# EasyEDA Pro project 无刷电机驱动板.epro, board PCB4
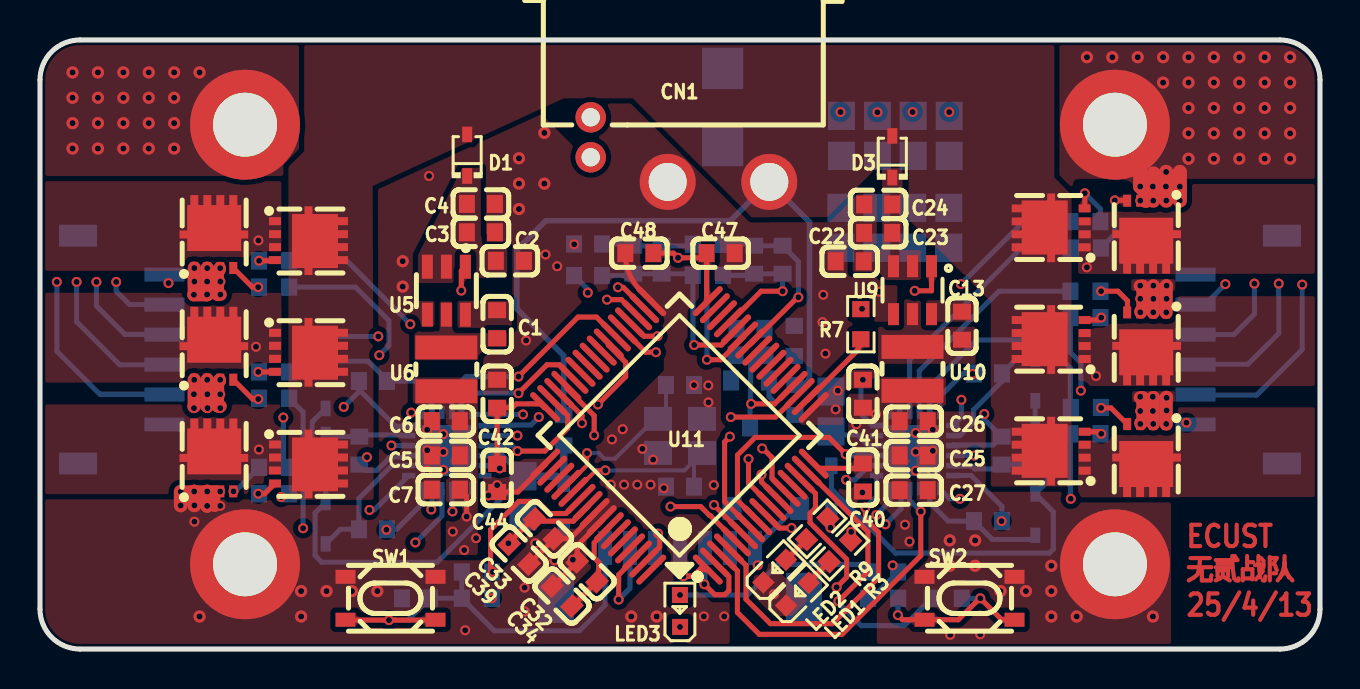
[diagram p11: board, top side]
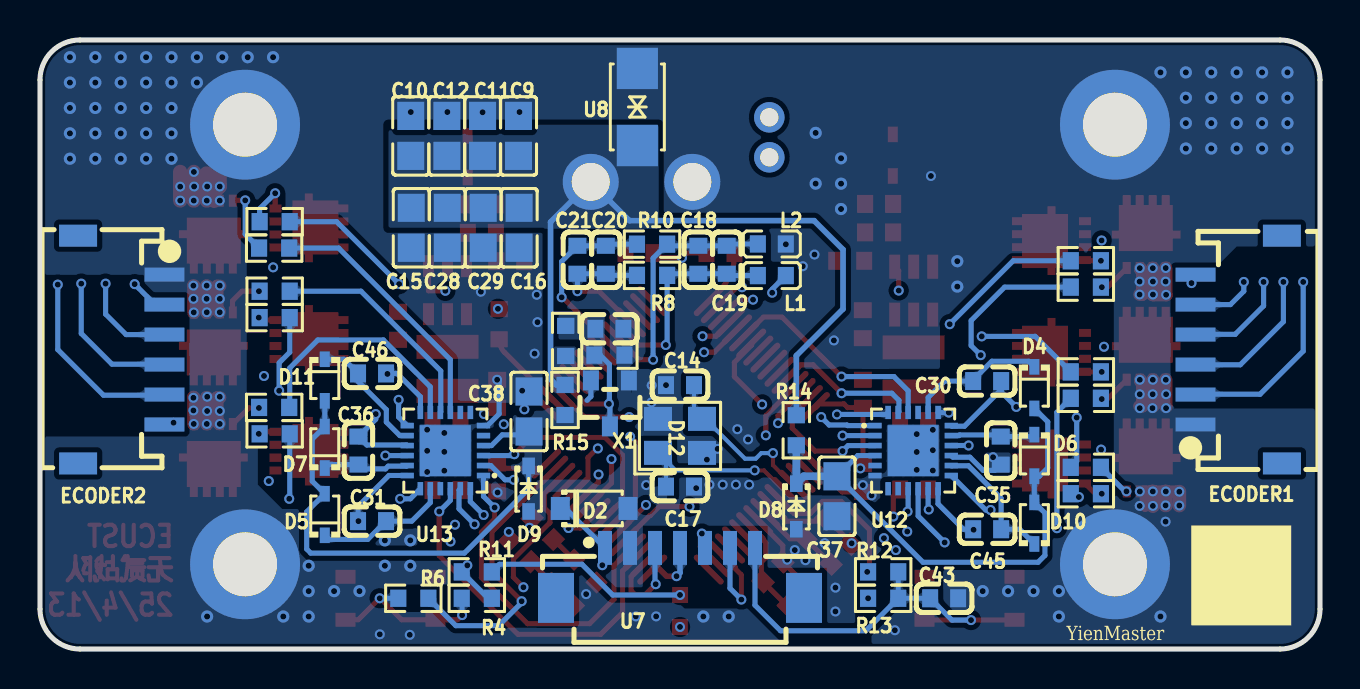
[diagram p12: board, bottom side, seen from below]

Outline 64.01 x 30.48 mm; copper layers: Top Layer, Inner1, Inner2, Bottom Layer. Coordinates in mm from the lower left corner of the outline.
Outline path: 0,28.48 0,2 arc(0.59,0.59) 2,0 62.01,0 arc(63.42,0.59) 64.01,2 64.01,28.48 arc(63.42,29.89) 62.01,30.48 2,30.48 arc(0.59,29.89) 0,28.48
Stack: Top Layer 0.035mm 外层铜厚1oz / Dielectric1 0.2104mm 7628 RC49% 8.6mil / Inner1 0.0152mm 内层铜厚 / Dielectric2 1.065mm 1.1mm H/HOZ Copper / Inner2 0.0152mm 内层铜厚 / Dielectric3 0.2104mm 7628 RC49% 8.6mil / Bottom Layer 0.035mm 外层铜厚1oz

## Design rules (mm)
net ECO_OUT: DP1
net ECO_IN: DP1
template: 自定义配置
spacing copperThickness1oz (default): track to track 0.102, other pairs 0.152 to 0.3
spacing copperThickness2oz: track to track 0.203, other pairs 0.152 to 0.3
track width copperThickness1oz (default): min 0.127, default 0.254, max 2.54
track width copperThickness2oz: min 0.203, default 0.254, max 2.54
differential pair differentialPair (default): width min 0.127, default 0.254, max 2.54; gap min 0.152, default 0.152
via viaSize (default): diameter min 0.5, default 0.61, max 10; hole min 0.3, default 0.305, max 6.3

## Placement (name value [footprint] x y rotation side)
C1  100nF  [C0603]  22.86 16.26 270 top
C2  10uF  [C0603]  23.5 19.43 180 top
C3  100nF  [C0603]  22.05 20.85 180 top
C4  10nF  [C0603]  22.05 22.28 180 top
C5  22uF  [C0603]  20.29 9.69 0 top
C6  22uF  [C0603]  20.29 11.4 0 top
C7  100nF  [C0603]  20.29 7.98 180 top
C9  22uF  [C0805]  40.08 25.68 270 bottom
C10  22uF  [C0805]  45.47 25.68 90 bottom
C11  22uF  [C0805]  41.88 25.68 270 bottom
C12  22uF  [C0805]  43.66 25.68 90 bottom
C13  100nF  [C0603]  46.1 16.18 270 top
C14  10pF  [C0603]  32 13.21 0 bottom
C15  22uF  [C0805]  45.44 21.08 90 bottom
C16  22uF  [C0805]  40.05 21.08 270 bottom
C17  10pF  [C0603]  32 8.13 0 bottom
C18  4.7uF  [C0603]  31.09 19.48 270 bottom
C19  100nF  [C0603]  29.67 19.48 270 bottom
C20  2.2uF  [C0603]  35.71 19.48 270 bottom
C21  100nF  [C0603]  37.13 19.48 270 bottom
C22  10uF  [C0603]  40.49 19.41 0 top
C23  100nF  [C0603]  41.91 20.83 0 top
C24  10nF  [C0603]  41.91 22.25 0 top
C25  22uF  [C0603]  43.69 9.68 180 top
C26  22uF  [C0603]  43.69 11.4 180 top
C27  100nF  [C0603]  43.69 7.95 0 top
C28  22uF  [C0805]  43.64 21.08 90 bottom
C29  22uF  [C0805]  41.85 21.08 270 bottom
C30  4.7uF  [C0603]  16.65 13.41 0 bottom
C31  4.7uF  [C0603]  47.4 6.4 180 bottom
C32  4.7uF  [C0603]  27.36 3.87 135 top
C33  4.7uF  [C0603]  25.22 6.01 315 top
C34  100nF  [C0603]  26.1 2.65 135 top
C35  4.7uF  [C0603]  15.97 9.93 90 bottom
C36  4.7uF  [C0603]  48.08 9.93 270 bottom
C37  22uF  [C0805]  24.16 7.65 90 bottom
C38  22uF  [C0805]  39.56 11.89 270 bottom
C39  100nF  [C0603]  23.96 4.75 315 top
C40  4.7uF  [C0603]  41.15 8.59 90 top
C41  100nF  [C0603]  41.15 12.78 270 top
C42  4.7uF  [C0603]  22.86 12.78 90 top
C43  100nF  [C0603]  18.8 2.54 0 bottom
C44  100nF  [C0603]  22.86 8.56 270 top
C45  4.7uF  [C0603]  16.65 5.99 0 bottom
C46  4.7uF  [C0603]  47.4 13.79 180 bottom
C47  4.7uF  [C0603]  34.04 19.81 180 top
C48  100nF  [C0603]  29.97 19.81 0 top
C49  100nF  [C0603]  35.53 16.03 0 bottom
CN1  XT30PW(2+2)-M.G.B  [CONN-TH_4P-XT30PW-M]  32 24.99 180 top
D1  B5819WS  [SOD-323_L1.7-W1.3-LS2.5-FD]  21.36 24.71 270 top
D2  SMF3.3A  [SOD-123_L2.8-W1.8-LS3.7-RD]  36.3 7.04 180 bottom
D3  B5819WS  [SOD-323_L1.7-W1.3-LS2.5-FD]  42.62 24.64 270 top
D4  B5819WS  [SOD-323_L1.7-W1.3-LS2.5-FD]  14.28 13.08 90 bottom
D5  B5819WS  [SOD-323_L1.7-W1.3-LS2.5-FD]  49.77 6.73 270 bottom
D6  B5819WS  [SOD-323_L1.7-W1.3-LS2.5-FD]  14.28 9.69 90 bottom
D7  B5819WS  [SOD-323_L1.7-W1.3-LS2.5-FD]  49.77 10.1 270 bottom
D8  BZT52C15S  [SOD-323_L1.7-W1.3-LS2.6-RD]  26.19 7.14 270 bottom
D9  BZT52C15S  [SOD-323_L1.7-W1.3-LS2.6-RD]  39.57 8.03 270 bottom
D10  B5819WS  [SOD-323_L1.7-W1.3-LS2.5-FD]  14.28 6.3 270 bottom
D11  B5819WS  [SOD-323_L1.7-W1.3-LS2.5-FD]  49.77 13.46 90 bottom
D12  BAV99  [SOT-23_L2.9-W1.3-P1.90-LS2.4-BR]  35.51 12.29 90 bottom
ECODER1  ZH-6AWB  [CONN-SMD_6P-P1.50_ZH-6AWB]  4.06 14.99 90 bottom
ECODER2  ZH-6AWB  [CONN-SMD_6P-P1.50_ZH-6AWB]  59.94 14.99 270 bottom
L1  BLM18PG121SN1D  [L0603]  27.41 18.69 0 bottom
L2  BLM18PG121SN1D  [L0603]  27.41 20.27 0 bottom
LED1  NCD0603R1  [LED0603-RD_RED]  37.87 2.74 45 top
LED2  NCD0603R1  [LED0603-RD_RED]  36.74 3.9 45 top
LED3  NCD0603R1  [LED0603-RD_RED]  32 1.91 90 top
R3  10kΩ  [R0603]  40 4.9 225 top
R4  4.7kΩ  [R0603]  42.16 2.54 0 bottom
R6  100Ω  [R0603]  45.34 2.54 0 bottom
R7  100Ω  [R0603]  41.05 16.26 90 top
R8  0Ω  [R0603]  33.4 18.7 0 bottom
R9  1kΩ  [R0603]  38.86 6.01 225 top
R10  0Ω  [R0603]  33.4 20.26 0 bottom
R11  1kΩ  [R0603]  42.16 3.86 180 bottom
R12  100Ω  [R0603]  21.84 3.86 0 bottom
R13  10kΩ  [R0603]  21.84 2.54 0 bottom
R14  100Ω  [R0603]  26.19 10.95 270 bottom
R15  100Ω  [R0603]  37.75 12.47 270 bottom
R16  4.7Ω  [R0603]  11.71 19.43 180 bottom
R17  4.7Ω  [R0603]  11.71 13.87 180 bottom
R18  4.7Ω  [R0603]  11.71 7.77 180 bottom
R19  4.7Ω  [R0603]  52.27 10.77 0 bottom
R20  4.7Ω  [R0603]  52.27 16.59 0 bottom
R21  4.7Ω  [R0603]  52.27 21.39 0 bottom
R22  4.7Ω  [R0603]  11.71 18.11 180 bottom
R23  4.7Ω  [R0603]  11.71 12.55 180 bottom
R24  4.7Ω  [R0603]  11.71 9.09 180 bottom
R25  4.7Ω  [R0603]  52.3 12.09 0 bottom
R26  4.7Ω  [R0603]  52.27 17.91 0 bottom
R27  4.7Ω  [R0603]  52.3 20.07 0 bottom
R28  10kΩ  [R0603]  37.72 15.42 270 bottom
R29  1kΩ  [R0603]  35.53 14.71 0 bottom
SW1  TS3425BA  [SW-SMD_4P-L4.2-W3.2-P2.15-LS4.6-1]  17.53 2.54 0 top
SW2  TS3425BA  [SW-SMD_4P-L4.2-W3.2-P2.15-LS4.6-1]  46.48 2.54 0 top
U1  -  [M3螺丝孔]  10.25 26.24 0 top
U2  -  [M3螺丝孔]  53.75 26.24 0 top
U3  -  [M3螺丝孔]  10.25 4.24 0 top
U4  -  [M3螺丝孔]  53.75 4.24 0 top
U5  AP63205WU-7  [TSOT-23-6_L2.9-W1.6-P0.95-LS2.8-BL]  20.32 17.93 180 top
U6  4.7uH  [IND-SMD_L3.0-W3.0_FTC303020D]  20.32 14 270 top
U7  ZX-MX1.25-7PWT  [CONN-SMD_7P-P1.25_ZX-MX1.25-7PWT]  32 3.81 0 bottom
U8  SMAJ16CA  [DO-214AC_L4.3-W2.7-LS5.0-BI]  34.14 27.13 90 bottom
U9  AP63203WU-7  [TSOT-26_L2.9-W1.6-P0.95-LS2.8-BL]  43.63 17.96 180 top
U10  4.7uH  [IND-SMD_L3.0-W3.0_FTC303020D]  43.63 14.02 270 top
U11  CYT2BL3CAAQ0AZEGST  [LQFP-64_L10.0-W10.0-P0.50-LS12.0-BL]  31.98 10.69 45 top
U12  FD6288Q  [QFN-24_L4.0-W4.0-P0.50-BL-EP2.6]  20.34 9.93 270 bottom
U13  FD6288Q  [QFN-24_L4.0-W4.0-P0.50-BL-EP2.6]  43.74 9.93 90 bottom
U14  TPN2R703NL,L1Q(M  [TSON-8_L3.1-W3.1-P0.65-LS3.3-BL-EP]  13.43 20.44 270 top
U15  TPN2R703NL,L1Q(M  [TSON-8_L3.1-W3.1-P0.65-LS3.3-BL-EP]  13.43 14.85 270 top
U16  TPN2R703NL,L1Q(M  [TSON-8_L3.1-W3.1-P0.65-LS3.3-BL-EP]  13.43 9.26 270 top
U17  TPN2R703NL,L1Q(M  [TSON-8_L3.1-W3.1-P0.65-LS3.3-BL-EP]  50.56 9.9 90 top
U18  TPN2R703NL,L1Q(M  [TSON-8_L3.1-W3.1-P0.65-LS3.3-BL-EP]  50.56 15.49 90 top
U19  TPN2R703NL,L1Q(M  [TSON-8_L3.1-W3.1-P0.65-LS3.3-BL-EP]  50.56 21.08 90 top
U20  TPN2R703NL,L1Q(M  [TSON-8_L3.1-W3.1-P0.65-LS3.3-BL-EP]  8.69 20.74 0 top
U21  TPN2R703NL,L1Q(M  [TSON-8_L3.1-W3.1-P0.65-LS3.3-BL-EP]  8.69 15.15 0 top
U22  TPN2R703NL,L1Q(M  [TSON-8_L3.1-W3.1-P0.65-LS3.3-BL-EP]  8.69 9.57 0 top
U23  TPN2R703NL,L1Q(M  [TSON-8_L3.1-W3.1-P0.65-LS3.3-BL-EP]  55.34 9.58 180 top
U24  TPN2R703NL,L1Q(M  [TSON-8_L3.1-W3.1-P0.65-LS3.3-BL-EP]  55.34 15.17 180 top
U25  TPN2R703NL,L1Q(M  [TSON-8_L3.1-W3.1-P0.65-LS3.3-BL-EP]  55.34 20.76 180 top
U26  -  [JLC-QRCODE-5x5]  3.94 3.68 180 bottom
X1  16MHz  [CRYSTAL-SMD_4P-L3.2-W2.5-BL]  32 10.67 180 bottom

## Footprints (pads in the part's own frame, mm; a bottom-side part is the same pattern mirrored in y, then rotated)
C0603
  rect 0.8x0.9 smd: 1(-0.7,0) 2(0.7,0)
C0805
  rect 1.41x1.35 smd: 1(-1,0) 2(1,0)
CONN-SMD_6P-P1.50_ZH-6AWB
  rect 0.7x2 smd: 1(-3.75,2.16) 2(-2.25,2.16) 3(-0.75,2.16) 4(0.75,2.16) 5(2.25,2.16) 6(3.75,2.16)
  rect 1.1x1.9 smd: 7(5.7,-2.159) 8(-5.7,-2.16)
CONN-SMD_7P-P1.25_ZX-MX1.25-7PWT
  rect 0.7x1.7 smd: 1(3.75,-1.25) 2(2.5,-1.25) 3(1.25,-1.25) 4(0,-1.25) 5(-1.25,-1.25) 6(-2.5,-1.25) 7(-3.75,-1.25)
  rect 1.8x2.5 smd: 8(-6.2,1.25) 9(6.2,1.25)
CONN-TH_4P-XT30PW-M
  round 2.8 hole 1.9: 1(-4.465,1.615) 2(0.615,1.615)
  round 1.524 hole 0.914: 3(4.465,0.385) 4(4.465,-1.615)
CRYSTAL-SMD_4P-L3.2-W2.5-BL
  rect 1.4x1.2 smd: 1(-1.1,-0.85) 2(1.1,-0.85) 3(1.1,0.85) 4(-1.1,0.85)
DO-214AC_L4.3-W2.7-LS5.0-BI
  rect 2.07x2.06 smd: 1(-1.929,0) 2(1.929,0)
IND-SMD_L3.0-W3.0_FTC303020D
  rect 1.2x3.1 smd: 1(-1.1,0) 2(1.1,0)
L0603
  rect 0.8x0.864 smd: 1(-0.7,0) 2(0.7,0)
LED0603-RD_RED
  rect 0.8x0.8 smd: 1(-0.799,-0.004) 2(0.799,0.004)
LQFP-64_L10.0-W10.0-P0.50-LS12.0-BL
  oval 0.3x2 smd: 1(-3.75,-5.75) 2(-3.25,-5.75) 3(-2.75,-5.75) 4(-2.25,-5.75) 5(-1.75,-5.75) 6(-1.25,-5.75) 7(-0.75,-5.75) 8(-0.25,-5.75) 9(0.25,-5.75) 10(0.75,-5.75) 11(1.25,-5.75) 12(1.75,-5.75) 13(2.25,-5.75) 14(2.75,-5.75) 15(3.25,-5.75) 16(3.75,-5.75) 33(3.75,5.75) 34(3.25,5.75) 35(2.75,5.75) 36(2.25,5.75) 37(1.75,5.75) 38(1.25,5.75) 39(0.75,5.75) 40(0.25,5.75) 41(-0.25,5.75) 42(-0.75,5.75) 43(-1.25,5.75) 44(-1.75,5.75) 45(-2.25,5.75) 46(-2.75,5.75) 47(-3.25,5.75) 48(-3.75,5.75)
  oval 2x0.3 smd: 17(5.75,-3.75) 18(5.75,-3.25) 19(5.75,-2.75) 20(5.75,-2.25) 21(5.75,-1.75) 22(5.75,-1.25) 23(5.75,-0.75) 24(5.75,-0.25) 25(5.75,0.25) 26(5.75,0.75) 27(5.75,1.25) 28(5.75,1.75) 29(5.75,2.25) 30(5.75,2.75) 31(5.75,3.25) 32(5.75,3.75) 49(-5.75,3.75) 50(-5.75,3.25) 51(-5.75,2.75) 52(-5.75,2.25) 53(-5.75,1.75) 54(-5.75,1.25) 55(-5.75,0.75) 56(-5.75,0.25) 57(-5.75,-0.25) 58(-5.75,-0.75) 59(-5.75,-1.25) 60(-5.75,-1.75) 61(-5.75,-2.25) 62(-5.75,-2.75) 63(-5.75,-3.25) 64(-5.75,-3.75)
M3螺丝孔
  round 5.5 hole 3.2: 1(0,0)
QFN-24_L4.0-W4.0-P0.50-BL-EP2.6
  rect 0.28x0.665 smd: 1(-1.25,-1.907) 2(-0.75,-1.907) 3(-0.25,-1.907) 4(0.25,-1.907) 5(0.75,-1.907) 6(1.25,-1.907) 13(1.25,1.907) 14(0.75,1.907) 15(0.25,1.907) 16(-0.25,1.907) 17(-0.75,1.907) 18(-1.25,1.907)
  rect 0.665x0.28 smd: 7(1.907,-1.25) 8(1.907,-0.75) 9(1.907,-0.25) 10(1.907,0.25) 11(1.907,0.75) 12(1.907,1.25) 19(-1.907,1.25) 20(-1.907,0.75) 21(-1.907,0.25) 22(-1.907,-0.25) 23(-1.907,-0.75) 24(-1.907,-1.25)
  rect 2.55x2.55 smd: 25(0,0)
R0603
  rect 0.806x0.864 smd: 1(-0.753,0) 2(0.753,0)
SOD-123_L2.8-W1.8-LS3.7-RD
  rect 0.95x1.15 smd: 1(-1.692,0) 2(1.692,0)
SOD-323_L1.7-W1.3-LS2.5-FD
  rect 0.78x0.5 smd: 1(-1.04,0) 2(1.04,0)
SOD-323_L1.7-W1.3-LS2.6-RD
  rect 0.83x0.63 smd: 1(-1.14,0) 2(1.14,0)
SOT-23_L2.9-W1.3-P1.90-LS2.4-BR
  rect 1x0.8 smd: 1(1.15,-0.95) 2(1.15,0.95) 3(-1.15,0)
SW-SMD_4P-L4.2-W3.2-P2.15-LS4.6-1
  rect 1x0.7 smd: 1(-2.25,1.075) 2(2.25,1.075) 3(-2.25,-1.075) 4(2.25,-1.075)
TSON-8_L3.1-W3.1-P0.65-LS3.3-BL-EP
  rect 0.4x0.6 smd: 1(-0.975,-1.675) 2(-0.325,-1.675) 3(0.325,-1.675) 4(0.975,-1.675) 5(0.975,1.675) 6(0.325,1.675) 7(-0.325,1.675) 8(-0.975,1.675)
  rect 0.6x0.4 smd: 9(-1.42,0) 9(1.42,0)
  rect 2.7x2.3 smd: 9(0.02,0.325)
TSOT-23-6_L2.9-W1.6-P0.95-LS2.8-BL
  rect 0.55x1.2 smd: 1(-0.95,-1.2) 2(0,-1.2) 3(0.95,-1.2) 4(0.95,1.2) 5(0,1.2) 6(-0.95,1.2)
TSOT-26_L2.9-W1.6-P0.95-LS2.8-BL
  rect 0.55x1.1 smd: 1(-0.95,-1.2) 2(0,-1.2) 3(0.95,-1.2) 4(0.95,1.2) 5(0,1.2) 6(-0.95,1.2)

## Nets
As in the schematic.

Pads without a net: ECODER1 7 8; ECODER2 7 8; U7 8 9; U11 13 21 22 23 24 25 30 31 40 41 42 43 50 51 59 60 61 64; U12 5 7 8 21; U13 5 7 8 21

## Via types
v1: diameter 0.5, hole 0.3, Top Layer to Bottom Layer, 228 vias
v2: diameter 0.61, hole 0.305, Top Layer to Bottom Layer, 77 vias

## Routing (per net, layer and track width the routed paths; a pad name or vN(x,y) marks a point on that pad's centre or on a via; arc(x,y) is an arc through that point)
+5V: length 122.5
  Top Layer w0.254: C7.1 21.34,7.63 v1(21.34,6.63) ; v1(21.07,17.94) 21.07,18.93 U5.1
  Inner2 w0.254: 21.9,14.5 25.3,14.5 26.21,13.59 26.21,7.42 27.03,6.6 40.56,6.6 v1(40.56,5.86) ; 21.84,7.13 21.81,7.1 v1(21.34,6.63) ; 21.81,11.8 21.84,11.76 ; v1(21.07,17.94) 21.74,17.94
  Inner2 w0.381: v1(21.81,5.55) 21.81,24.27 26.52,28.98 36.32,28.98 44.89,20.41 55.89,20.41 57.71,18.59 57.71,11.71 v1(57.33,11.33) ; v1(20.64,5.88) 20.6,5.84 19.23,5.84 16.54,8.53 8.92,8.53 6.42,11.03 6.42,18.31 v1(6.43,18.31)
  vias: v1(21.21,4.95)
GND: length 48
  Top Layer w0.254: C48.1 29.27,19.76 arc(29.47,18.78) 30.02,17.96 30.59,17.39 ; 28.12,6.43 26.87,5.18 C32.2 25.64,3.14 C34.2 ; 27.76,6.78 26.5,5.52 25.72,5.52 C39.2 ; 25.29,9.25 23.89,7.86 C44.2
  Top Layer w0.508: 8.76,7.92 8.76,7.14 8.74,7.11
  Top Layer w0.635: 55.05,16.85 55.05,16.9 55.15,17 55.15,18.16 55.13,18.17 55.01,18.17 ; 8.76,7.87 v1(7.04,7.87) ; v1(9.02,17.74) 8.89,17.74 8.88,17.75 8.88,18.91 8.98,19.01 8.98,19.06 ; 55.01,12.59 55.13,12.59 55.15,12.58 55.15,11.42 55.05,11.32 55.05,11.26 ; 8.98,13.47 8.98,13.42 8.88,13.32 8.88,12.16 8.89,12.15 9.02,12.15
  Top Layer w0.66: v1(8.36,19.06) 8.36,17.75 v1(8.35,17.74) 8.34,17.73 v1(7.7,17.73) 7.72,17.75 v1(7.72,19.07) ; U21.1 7.72,12.16 7.7,12.14 ; 8.35,12.15 8.36,12.16 v1(8.36,13.47) ; 56.33,12.6 56.31,12.58 U23.1 ; v1(55.67,11.26) 55.67,12.58 55.68,12.59 ; 56.33,18.18 56.31,18.16 56.31,16.84 ; 55.67,16.85 55.67,18.16 55.68,18.17
  Top Layer w0.686: v1(7.04,7.87) v1(7.04,7.18) ; v1(7.71,7.89) 7.71,7.2 v1(7.72,7.19) ; v1(8.36,7.16) 8.36,7.17 v1(8.36,7.89)
  Top Layer w0.711: v1(56.31,23.88) 56.31,23.16 v1(56.3,23.15) 56.32,23.13 v1(56.32,22.44) ; U2.1 55.02,24.98 v1(55.02,23.15) 55.3,22.87 55.3,22.43 ; v1(57,22.44) v1(57,23.14) 57,23.88 ; 55.68,23.8 55.68,23.17 v1(55.65,23.15) 55.67,23.13 v1(55.67,22.44)
  Bottom Layer w0.254: v1(41.15,13.48) 41.05,13.38 41.05,11.76 41.63,11.18 U13.6
  vias: v1(7.72,18.39) v1(7.71,13.47) v1(7.7,12.75) v1(7.7,12.06) v1(7.72,6.38) v1(8.36,18.39) v1(8.37,12.75) v1(8.38,12.06) v1(9.01,19.06) v1(9.02,18.39) v1(9.01,13.47) v1(9.01,12.75) v1(9.01,12.06) v1(9.01,7.89) v1(9.02,7.16) v1(19.36,10.97) v1(19.36,9.95) v1(19.36,8.93) v1(19.46,23.67) v1(20.17,10.76) v1(20.17,9.86) v1(20.17,8.97) v1(21.26,0.94) v1(22.43,7.69) v1(22.86,8.2) v1(24.23,3.07) v1(24.23,1.88) v1(24.31,15.44) v1(24.77,5.3) v1(25.28,19.74) v1(25.73,4.45) v1(25.86,19.16) v1(26.26,4.95) v1(26.64,4.47) v1(26.71,20.25) v1(28.55,8.23) v1(28.6,10.49) v1(29.14,11) v1(29.21,8.23) v1(29.87,8.23) v1(30.12,10.02) v1(30.53,8.23) v1(30.66,9.48) v1(31.2,8.05) v1(32.7,13.21) v1(33.2,1.63) v1(33.42,13.19) v1(33.43,12.34) v1(33.69,8.2) v1(34.21,1.63) v1(36.7,2.75) v1(39.13,16.36) v1(39.17,17.73) v1(39.28,14.78) v1(39.79,11.99) v1(39.9,12.93) v1(40.03,26.87) v1(41.12,7.83) v1(41.88,26.86) v1(41.96,17.88) v1(43.64,26.87) v1(43.79,10.81) v1(43.79,9.87) v1(43.79,8.92) v1(44.65,10.98) v1(44.65,9.92) v1(44.65,8.86) v1(45.47,26.87) v1(45.52,0.71) v1(47.02,0.74) v1(55.02,22.44) v1(55.02,18.19) v1(55.02,17.53) v1(55.02,16.85) v1(55.02,12.62) v1(55.02,11.91) v1(55.02,11.26) v1(55.65,12.62) v1(55.67,18.19) v1(55.68,17.53) v1(55.67,16.85) v1(55.65,11.91) v1(56.34,18.19) v1(56.33,17.53) v1(56.32,16.85) v1(56.34,12.57) v1(56.34,11.94) v1(56.32,11.26) v2(1.63,28.86) v2(1.63,27.59) v2(1.63,26.32) v2(1.63,25.05) v2(2.9,28.86) v2(2.9,27.59) v2(2.9,26.32) v2(2.9,25.05) v2(4.17,28.86) v2(4.17,27.59) v2(4.17,26.32) v2(4.17,25.05) v2(5.44,28.86) v2(5.44,27.59) v2(5.44,26.32) v2(5.44,25.05) v2(6.71,28.86) v2(6.71,27.59) v2(6.71,26.32) v2(6.71,25.05) v2(7.98,28.86) v2(7.98,1.63) v2(13.06,2.9) v2(13.06,1.63) v2(14.33,2.9) v2(15.6,2.9) v2(16.87,2.9) v2(18.14,19.41) v2(18.14,18.14) v2(23.95,24.56) v2(23.95,23.29) v2(23.95,22.02) v2(25.22,25.83) v2(25.22,23.29) v2(29.57,1.63) v2(30.84,1.63) v2(45.49,5.44) v2(45.49,4.17) v2(46.76,5.44) v2(46.76,4.17) v2(48.03,2.9) v2(49.3,2.9) v2(50.57,4.17) v2(50.57,2.9) v2(50.57,1.63) v2(51.84,1.63) v2(52.35,29.62) v2(53.62,29.62) v2(54.89,29.62) v2(55.65,1.63) v2(56.16,29.62) v2(56.16,28.35) v2(57.43,29.62) v2(57.43,28.35) v2(57.43,27.08) v2(57.43,25.81) v2(57.43,24.54) v2(58.7,29.62) v2(58.7,28.35) v2(58.7,27.08) v2(58.7,25.81) v2(58.7,24.54) v2(59.97,29.62) v2(59.97,28.35) v2(59.97,27.08) v2(59.97,25.81) v2(59.97,24.54) v2(61.24,29.62) v2(61.24,28.35) v2(61.24,27.08) v2(61.24,25.81) v2(61.24,24.54) v2(62.51,29.62) v2(62.51,28.35) v2(62.51,27.08) v2(62.51,25.81) v2(62.51,24.54)
VBAT: length 34.8
  Bottom Layer w0.28: R14.1 26.19,14.68 23.85,17.02 23.85,19.99 25.3,21.44 34.53,21.44 CN1.1 38.48,21.37 38.48,13.5 38.19,13.22 R15.1
VCC1V1: length 4.9
  Top Layer w0.254: C34.1 26.63,2.15 27.85,3.37 27.94,3.46 27.94,4.34 27.71,4.57 27.71,5.31 28.47,6.07
VCC3V3: length 133.4
  Top Layer w0.254: 27.41,7.13 26.67,6.4 24.53,6.4 v1(23.42,5.29) ; 25.29,12.08 25.22,12.08 25.03,12.27 23.81,12.27 23.62,12.08 22.87,12.08 C42.1 C44.1 ; C40.2 40.91,9.04 38.93,9.04 38.72,9.25 ; v1(43.74,17.93) 44.58,17.93 U9.1 ; C48.2 31.67,19.81 v1(31.91,19.58) 33.1,19.58 C47.2 33.34,17.47 33.39,17.41
  Inner2 w0.254: v1(41.81,11.76) 43.74,13.69 v1(43.74,17.93) ; v1(40.82,11.25) 40.69,11.25 37.47,8.03 35.08,8.03 27.4,15.71 v1(27.4,17.83) ; 43.41,5.31 43.38,5.33 40.27,5.33 v1(39.53,6.07) ; 43.41,5.31 43.21,5.11 37.3,5.11 37.3,5.1 26.93,5.1 v1(22.99,9.04) ; 43.41,5.31 v1(43.48,5.38) ; 40.51,12.17 40.51,18.21 39.15,19.58 v1(31.91,19.58)
  Inner2 w0.381: 43.43,4.22 43.41,4.2 v1(35.89,4.2) ; v1(22.6,2.54) 23.42,2.54 ; 23.42,2.54 23.42,1.83 24.76,0.49 43.07,0.49 43.56,0.98 43.56,1.88 43.48,1.96 v1(43.48,5.38) ; 23.42,2.54 v1(23.42,5.29)
  Bottom Layer w0.254: L1.1 27.4,18.01 v1(27.4,17.83) ; U7.1 37.78,7.09 38.04,7.09 ; 36.46,13.44 36.46,12.64 36.65,12.45 ; R11.1 41.6,2.54 R4.1
  vias: v1(42.64,4.19) v1(43.26,6.22)
VDDA: length 10.6
  Top Layer w0.254: 34.83,15.97 34.08,15.21 v1(32.72,15.21)
  Bottom Layer w0.254: v1(32.72,15.21) 32.65,15.28 R8.1 32.57,18.78 C18.2 C19.2 29.57,18.69 28.11,18.69
VSSA: length 13
  Top Layer w0.254: v1(33.35,14.48) 34.05,14.48 35.19,15.62
  Bottom Layer w0.254: 28.11,20.27 29.58,20.27 C19.1 C18.1 32.57,20.18 R10.1 33.35,19.56 v1(33.35,14.48)
BATADC: length 6.5
  Top Layer w0.254: 37.6,13.14 36.73,12.27 v1(35.56,12.27)
  Bottom Layer w0.254: 35.51,11.14 35.51,12.22 v1(35.56,12.27) 35.53,12.29 35.53,14.25 35.99,14.71 R29.2
DBG_RX: length 2.9
  Top Layer w0.28: v1(32.18,3.65) 32.68,3.65 33.07,4.04 33.12,3.99 33.4,3.99
  Bottom Layer w0.28: v1(32.18,3.65) 32,3.82 U7.4
DBG_TX: length 5
  Top Layer w0.254: v1(33.22,3.24) 33.74,2.72 34.24,2.72 34.45,2.93 34.45,3.63 33.77,4.3
  Bottom Layer w0.254: v1(33.22,3.24) 33.25,3.28 U7.3
ECD1_CS: length 56.3
  Top Layer w0.254: v1(36.11,10.04) 36.15,10.04 36.61,9.58 36.61,8.54 37.31,7.84
  Inner1 w0.254: 0.84,18.22 0.84,20.32 3.56,23.04 21.23,23.04 34.24,10.04 v1(36.11,10.04)
  Bottom Layer w0.254: v1(0.84,18.37) 0.84,14.91 3,12.75 6.21,12.75 ECODER1.2
ECD1_MISO: length 53.5
  Top Layer w0.254: v1(37.58,6.05) 36.97,6.05 36.25,6.78
  Inner1 w0.254: v1(37.58,6.05) 33.42,6.05 31.72,7.75 31.72,9.16 19.88,21.01 7.42,21.01 3.91,17.5 2.7,17.5 v1(1.83,18.37)
  Bottom Layer w0.254: v1(1.83,18.37) 1.83,16.38 3.99,14.22 6.21,14.22 ECODER1.3
ECD1_MOSI: length 48.8
  Top Layer w0.254: U11.10 35.43,8.3 v1(35.43,9.51)
  Inner1 w0.254: 2.82,18.32 2.82,20.32 4.83,22.33 20.75,22.33 33.57,9.51 v1(35.43,9.51)
  Bottom Layer w0.254: ECODER1.4 6.21,15.75 4.24,15.75 2.82,17.17 v1(2.82,18.37)
ECD1_SCLK: length 44.4
  Top Layer w0.254: v1(36.08,8.73) 36.08,8.36 36.95,7.49
  Inner1 w0.254: v1(3.81,18.37) 3.81,19.41 6.1,21.69 20.35,21.69 33.3,8.73 v1(36.08,8.73)
  Bottom Layer w0.254: ECODER1.5 4.48,17.24 3.81,17.91 v1(3.81,18.37)
ECD2_CS: length 38.6
  Top Layer w0.254: 29.15,16 30.29,14.85 v1(30.8,14.85)
  Inner1 w0.254: v1(30.8,14.85) 29.95,15.7 29.95,16.8 33.48,20.33 58.18,20.33 59.28,19.24 v1(59.28,18.26)
  Bottom Layer w0.254: ECODER2.2 58.25,17.24 v1(59.28,18.26)
ECD2_MISO: length 41.5
  Top Layer w0.254: v1(28.9,18.1) 29.16,18.1 U11.34
  Inner1 w0.254: v1(60.73,18.29) 60.73,19.59 59.34,20.98 31.85,20.98 28.98,18.1 v1(28.9,18.1)
  Bottom Layer w0.254: ECODER2.3 59.7,15.74 60.73,16.76 v1(60.73,18.29)
ECD2_MOSI: length 47.5
  Top Layer w0.254: v1(28.35,17.48) 29.08,17.48 29.88,16.68
  Inner1 w0.254: v1(28.35,17.48) 28.35,18.9 31.15,21.7 59.83,21.7 61.94,19.59 v1(61.94,18.29)
  Bottom Layer w0.254: v1(61.94,18.29) 61.94,15.79 60.41,14.25 57.8,14.25 ECODER2.4
ECD2_SCLK: length 46.5
  Top Layer w0.254: U11.36 30.2,15.65 v1(30.88,15.65)
  Inner1 w0.254: v1(30.88,15.65) 34.85,19.63 56.49,19.63 58.87,17.26 62.14,17.26 v1(63.12,18.24)
  Bottom Layer w0.254: v1(63.12,18.24) 63.12,14.99 60.84,12.7 57.82,12.7 ECODER2.5
ECO_IN: length 8.5
  Top Layer w0.203: v1(28.27,8.94) 27.8,8.94 26.7,7.84
  Bottom Layer w0.203: v1(28.27,8.94) 32.23,8.94 32.7,9.42 ; 32.7,9.42 X1.1 ; 32.7,9.42 C17.2
ECO_OUT: length 8.4
  Top Layer w0.203: 26.35,8.19 27.36,9.2 v1(27.36,9.8)
  Bottom Layer w0.203: v1(27.36,9.8) 27.94,9.8 28.22,9.53 28.75,9.53 30.75,11.52 X1.3 31.3,11.92 C14.1
HOA1: length 12.3
  Inner1 w0.254: v1(18.52,16.26) 18.52,11.88 v1(18.56,11.83)
  Bottom Layer w0.254: R16.1 15.34,19.43 v1(18.52,16.26) ; v1(18.56,11.83) 19.09,11.83 U12.19
HOA2: length 10
  Inner1 w0.254: v1(51.54,7.52) v1(46,7.52)
  Bottom Layer w0.254: U13.19 45.49,7.52 v1(46,7.52) ; R19.1 51.52,7.54 v1(51.54,7.52)
HOB1: length 11.8
  Inner1 w0.254: v1(17.57,10.19) 17.57,14.99 v1(16.92,15.65)
  Bottom Layer w0.254: v1(17.57,10.19) 18.43,10.19 U12.16 ; v1(16.92,15.65) 14.24,15.65 R17.1
HOB2: length 11.6
  Inner1 w0.254: v1(46.74,9.68) 49.98,12.93 v1(52.05,12.93)
  Bottom Layer w0.254: v1(52.05,12.93) 52.05,14.32 51.52,14.85 R20.1 ; U13.16 v1(46.74,9.68)
HOC1: length 7.8
  Inner1 w0.254: v1(12.06,7.61) 12.71,6.96 v1(16.48,6.96)
  Bottom Layer w0.254: U12.13 16.72,6.96 v1(16.48,6.96) ; v1(12.06,7.61) 12.3,7.61 R18.1
HOC2: length 14
  Inner1 w0.254: v1(46.05,18.26) 46.05,12.5 v1(46.08,12.47)
  Bottom Layer w0.254: v1(46.08,12.47) 46.08,11.61 U13.13 ; R21.1 49.17,21.39 v1(46.05,18.26)
KEYMOD: length 14.2
  Top Layer w0.254: v1(39.92,2.39) 41.4,3.87 41.4,5.87 38.37,8.9
  Bottom Layer w0.254: R6.1 43.21,1.17 41.07,1.17 39.92,2.32 v1(39.92,2.39)
LEDMOD: length 15.5
  Top Layer w0.254: 38.01,8.55 38.78,7.78 38.78,7.06 38.51,6.79 38.51,6.32 40.34,4.49 40.34,3.59 v1(39.83,3.09)
  Inner1 w0.254: v1(32,1.11) 37.85,1.11 v1(39.83,3.09)
LOA1: length 17.8
  Inner1 w0.254: v1(19.57,6.98) 18.95,6.98 16.97,8.97 v1(16.97,14.71)
  Bottom Layer w0.254: U12.11 19.59,7.01 v1(19.57,6.98) ; v1(16.97,14.71) 17.45,15.19 17.45,16.44 15.77,18.11 R22.1
LOA2: length 11.6
  Bottom Layer w0.254: U13.11 44.49,13.12 46.84,15.47 50.11,15.47 51.52,14.06 51.52,12.32
LOB1: length 15.9
  Inner1 w0.254: v1(13.16,6.05) 13.87,5.33 v1(18.77,5.33)
  Bottom Layer w0.254: R23.1 13.16,11.85 v1(13.16,6.05) ; v1(18.77,5.33) 20.09,6.66 U12.10
LOB2: length 11.3
  Bottom Layer w0.254: U13.10 43.97,11.86 43.97,13.92 47.96,17.91 R26.1
LOC1: length 14.7
  Inner1 w0.254: v1(12.17,11.58) 13.51,11.58 18.85,6.25 19.99,6.25 v1(20.62,6.88)
  Bottom Layer w0.254: v1(20.62,6.88) 20.59,6.91 U12.9 ; v1(12.17,11.58) 12.17,9.39 R24.1
LOC2: length 13
  Bottom Layer w0.254: 51.52,20.07 49.07,20.07 43.49,14.48 U13.9
PWM1AH: length 11.3
  Top Layer w0.254: 28.82,15.62 27.83,16.61 26.9,16.61 v1(23.93,13.64)
  Bottom Layer w0.254: U12.22 20.59,12.92 21.31,13.64 v1(23.93,13.64)
PWM1AL: length 10.4
  Top Layer w0.254: 28.47,15.26 28.42,15.22 28.42,15.21 29.29,14.35 29.29,13.63 v1(27.9,12.24)
  Inner1 w0.254: v1(24.94,11.61) 24.87,11.53 24.87,11.46 25.65,12.24 v1(27.9,12.24)
  Bottom Layer w0.254: U12.1 23.63,11.18 23.66,11.21 24.55,11.21 v1(24.94,11.61)
PWM1BH: length 7.3
  Top Layer w0.254: v1(23.93,12.8) 25.35,14.22 25.97,14.22 26.7,13.5
  Bottom Layer w0.254: U12.23 21.06,11.88 21.06,12.45 21.41,12.8 v1(23.93,12.8)
PWM1BL: length 8.7
  Top Layer w0.254: v1(27.71,10.69) 27.71,11.68 26.35,13.04 26.35,13.14
  Inner1 w0.254: v1(23.88,10.68) 24.17,10.39 27.43,10.39 27.71,10.67 v1(27.71,10.69)
  Bottom Layer w0.254: U12.2 v1(23.88,10.68)
PWM1CH: length 8.2
  Top Layer w0.254: 25.99,12.79 27.1,11.68 v1(27.1,11.3)
  Inner1 w0.254: v1(24.16,11.74) 24.16,11.43 24.65,10.93 26.73,10.93 v1(27.1,11.3)
  Bottom Layer w0.254: U12.24 21.69,11.74 v1(24.16,11.74)
PWM1CL: length 6.4
  Top Layer w0.254: 25.64,12.44 26.39,11.69 26.39,11.05 25.25,9.91 v1(23.88,9.91)
  Bottom Layer w0.254: U12.3 23.6,10.18 v1(23.88,9.91)
PWM2AH: length 18
  Top Layer w0.254: 34.12,4.66 34.87,3.91 34.87,1.83 35.97,0.74 40.11,0.74 44.04,4.67 v1(44.04,6.88)
  Bottom Layer w0.254: U13.22 43.49,7.44 v1(44.04,6.88)
PWM2AL: length 16.6
  Top Layer w0.254: 34.48,5.01 35.31,4.18 35.31,2.49 36.53,1.27 39.62,1.27 41.94,3.58 41.94,5.84 41.27,6.5 v1(41.27,7.08)
  Bottom Layer w0.254: v1(41.27,7.08) 41.83,7.64 U13.1
PWM2BH: length 20.3
  Top Layer w0.254: 34.83,5.37 33.52,6.68 33.49,6.68 33.04,7.13 v1(31.53,7.13)
  Inner1 w0.254: v1(42.28,6.24) 39.66,3.62 33.59,3.62 31.53,5.68 v1(31.53,7.13)
  Bottom Layer w0.254: v1(42.28,6.24) 43.05,7.02 43.05,7.96 U13.23
PWM2BL: length 11
  Top Layer w0.254: 35.19,5.72 33.72,7.19 33.71,7.19
  Inner1 w0.254: v1(33.71,7.21) 39.06,7.21 v1(40.31,8.47)
  Bottom Layer w0.254: v1(40.31,8.47) 40.75,8.47 41.46,9.18 U13.2
PWM2CH: length 17.5
  Top Layer w0.254: 35.54,6.07 34.24,7.38 34.24,10.37 v1(34.5,10.63)
  Inner1 w0.254: v1(41.82,6.71) 41.82,8.96 39.63,11.15 35.02,11.15 v1(34.5,10.63)
  Bottom Layer w0.254: U13.24 42.49,7.38 v1(41.82,6.71)
PWM2CL: length 11.4
  Top Layer w0.254: v1(40.29,9.75) 39.45,10.59 35.77,10.59 34.88,9.7 34.88,7.44 35.89,6.43
  Bottom Layer w0.254: v1(40.29,9.75) 40.36,9.68 U13.3
RST: length 21.1
  Top Layer w0.254: SW1.3 15.29,1.45 v1(17.45,1.45) 19.76,1.45 SW1.4
  Bottom Layer w0.254: R13.1 C43.2 18.4,1.45 17.5,1.45 ; R13.1 22.72,0.91 26.97,0.91 28.25,2.19 U7.7 ; R13.1 R12.1
SWCLK: length 5.4
  Top Layer w0.254: 29.88,4.66 28.94,3.71 v1(28.94,2.48)
  Bottom Layer w0.254: U7.6 29.5,3.04 v1(28.94,2.48)
SWDIO: length 1.8
  Top Layer w0.254: 30.21,4.33 30.99,5.11 30.99,5.7 v1(30.91,5.78)
UART_RX: length 4.1
  Top Layer w0.254: 38.37,12.44 40.77,14.84 arc(40.98,15.15) R7.1
UART_TX: length 23.2
  Top Layer w0.254: U11.19 36.78,11.61 v1(34.54,11.61)
  Inner2 w0.254: CN1.4 27.54,26.6 25.91,24.97 25.91,23.42 34.04,15.29 34.04,12.12 v1(34.54,11.61)
VBA1: length 7
  Bottom Layer w0.254: U12.20 19.59,12.59 18.77,13.41 C30.2 17.35,13.46 16.41,14.4 14.56,14.4 D4.2
VBA2: length 6.8
  Bottom Layer w0.254: U13.20 44.49,7.33 45.41,6.4 C31.2 47.62,5.49 49.56,5.49 D5.2
VBB1: length 4.2
  Bottom Layer w0.254: D6.2 14.38,10.63 C35.2 16.05,10.71 18.02,10.71 18.05,10.68 U12.17
VBB2: length 4.4
  Bottom Layer w0.254: U13.17 45.68,9.15 46.6,9.15 46.73,9.01 47.87,9.01 C36.2 49.59,9.23 D7.2
VBC1: length 6.7
  Bottom Layer w0.254: U12.14 18.43,9.17 17.58,9.17 15.95,7.54 C45.1 15.02,5.99 D10.2
VBC2: length 6.3
  Bottom Layer w0.254: U13.14 46.01,10.68 46.69,11.36 46.69,11.98 48.1,13.39 C46.1 48.81,14.5 D11.2
VREFH: length 7.2
  Top Layer w0.254: v1(37.13,17.91) 36.06,17.91 34.48,16.32
  Bottom Layer w0.254: R8.2 35.63,18.7 C20.2 C21.2 v1(37.13,17.91)
VREFL: length 9.3
  Top Layer w0.254: 35.54,15.26 37.88,17.6 v1(37.92,17.6)
  Bottom Layer w0.254: R10.2 35.63,20.26 C20.1 C21.1 37.92,19.39 v1(37.92,17.6)
VSA1: length 15
  Inner1 w0.254: v1(10.92,20.45) 15.19,16.18 v1(15.19,12.12)
  Bottom Layer w0.254: 15.95,12.98 17.78,11.15 18.41,11.15 U12.18 ; 15.95,12.98 C30.1 ; 15.95,12.98 15.95,12.87 v1(15.19,12.12)
VSA2: length 9.6
  Inner1 w0.254: v1(48.08,6.4) 51.36,6.4 52.57,7.61 v1(52.57,8.41)
  Bottom Layer w0.254: C31.1 48.1,7.14 46.56,8.69 45.65,8.69 U13.18
VSB1: length 10.7
  Inner1 w0.254: v1(16.35,9.6) 16.33,9.6 10.85,15.08 10.85,15.08 v1(10.8,15.13)
  Bottom Layer w0.254: U12.15 18.36,9.6 17.5,9.6 16.84,8.94 16.26,8.94 C35.1
VSB2: length 10.5
  Inner1 w0.254: v1(52.81,13.67) 49.12,13.67 v1(47.22,11.76)
  Bottom Layer w0.254: v1(47.22,11.76) 47.22,11.5 C36.1 47.66,10.21 45.68,10.21 U13.15
VSC1: length 11.7
  Inner1 w0.254: v1(17.32,5.97) 17.32,6.98 16.74,7.57 13.36,7.57 v1(10.95,9.98)
  Bottom Layer w0.254: C45.2 17.83,5.99 19.1,7.26 19.1,8.02 U12.12
VSC2: length 10.9
  Inner1 w0.254: v1(46.63,13.77) 47.02,13.77 v1(52.35,19.1)
  Bottom Layer w0.254: C46.2 46.15,13.79 44.98,12.62 44.98,11.84 U13.12
XRES_L: length 7.8
  Top Layer w0.254: v1(22.64,3.86) 22.53,3.98 22.53,5.97 23.95,7.39 24.88,7.39 25.49,6.78 26.3,6.78 U11.54
$1N10004: length 8.6
  Top Layer w0.254: v1(42.9,1.7) 43.13,1.47 SW2.3 45.92,1.47 47,2.54 v1(47.02,2.54) 48.1,1.47 SW2.4
  Bottom Layer w0.254: R4.2 42.9,2.52 v1(42.9,1.7) ; R6.2 46.96,2.54 46.99,2.57
$1N10532: length 1.4
  Top Layer w0.254: R9.2 37.32,4.47 LED2.2
$1N10536: length 10.2
  Bottom Layer w0.254: v1(32,2.71) 35.37,2.71 36.91,4.24 41.03,4.24 R11.2
$1N11617: length 1.5
  Top Layer w0.254: 38.43,3.31 38.43,3.34 R3.2
$1N13568: length 27
  Bottom Layer w0.254: U12.4 23.12,9.68 C37.2 19.85,4.34 14.1,4.34 13.75,4.69 13.75,6.81 D10.1 D6.1 14.03,8.65 13.61,9.07 13.61,11.37 D4.1
  Bottom Layer w0.381: R14.2 D8.1 25.82,8.65 C37.2
$1N14919: length 24.6
  Bottom Layer w0.254: D9.1 39.57,8.01 42.78,4.8 50.47,4.8 50.67,5 50.67,6.86 D5.1 50.39,8.4 50.39,10.51 D7.1 D11.1 ; C38.2 39.72,10.72 40.89,10.72 41.43,10.18 U13.4
$1N15713: length 0.8
  Top Layer w0.254: v1(10.96,19.43) 11.72,19.43 U14.4
$1N16660: length 0.8
  Top Layer w0.254: v1(10.91,13.87) 11.75,13.87 U15.4
$1N16734: length 1
  Top Layer w0.254: U16.4 11.24,7.77 v1(10.91,7.77)
$1N16932: length 1.6
  Top Layer w0.254: v1(10.91,18.11) 10.62,18.11 U20.4
$1N16944: length 1.7
  Top Layer w0.254: v1(10.91,12.51) 10.63,12.51 U21.4
$1N16956: length 1.8
  Bottom Layer w0.254: R24.2 9.75,7.89 v1(9.68,7.89)
$1N17340: length 0.9
  Top Layer w0.254: v1(53.07,10.77) 52.96,10.88 U17.4
$1N17352: length 0.9
  Top Layer w0.254: 52.24,16.46 52.94,16.46 v1(53.07,16.59)
$1N17364: length 2.5
  Top Layer w0.254: v1(52.25,22.81) 52.25,22.06 U19.4
  Bottom Layer w0.254: v1(52.25,22.81) 53.03,22.03 R21.2
$1N17376: length 1.7
  Top Layer w0.254: v1(53.06,12.06) 53.56,12.06 U23.4
  Bottom Layer w0.254: v1(53.06,12.06) 53.05,12.07 R25.2
$1N17388: length 2.1
  Top Layer w0.254: v1(53.06,17.91) 53.9,17.91 54.38,17.42 54.38,16.87 U24.4
  Bottom Layer w0.254: v1(53.06,17.91) R26.2
$1N17400: length 3.3
  Top Layer w0.254: v1(53.75,22.45) 54.35,22.45 U25.4
  Bottom Layer w0.254: R27.2 53.75,20.76 v1(53.75,22.45)
$1N18423: length 21
  Inner2 w0.254: CN1.3 28.94,26.01 37.52,26.01 41.11,22.42 v1(41.11,17.03)

## Copper pours and planes (outline as drawn; the poured copper is in the pictures)
+5V on Top Layer: 21.9,13.59 18.64,13.59 18.64,12.29 18.82,12.12 19.91,12.12 20.29,11.73 20.29,4.7 21.9,4.7
+5V on Inner2: 21.34,7 20.27,5.94 20.27,5.4 20.97,4.7 21.41,4.7 22.17,5.46 22.17,6.16
GND on Top Layer: -2.03,33.73 67.08,33.73 67.08,-3.56 -2.03,-3.56
GND on Bottom Layer: -9.53,41.15 73.91,41.15 73.91,-12.7 -9.53,-12.7
GND on Inner1: -4.17,35.59 68.86,35.59 68.86,-5.71 -4.17,-5.71
GND on Inner2: -6.4,37.47 71.58,37.47 71.58,-9.47 -6.4,-9.47
VBAT on Top Layer: 36.47,21.61 35.59,21.61 29.64,27.56 26.19,27.56 16.64,23.17 16.69,7.47 12.42,7.47 12.42,24.13 13.21,24.92 13.21,30.28 13.23,30.3 50.72,30.3 50.72,23.6 51.59,22.73 51.59,8.13 47.55,8.13 47.55,17.37 43.43,21.49 43.43,24.33 42.09,24.33 39.37,21.62 36.48,21.62
VBAT on Bottom Layer: 37.19,15.14 38.33,15.14 38.33,12.8 37.19,12.8
VBAT on Bottom Layer: 33.07,26.24 46.58,26.24 46.58,21.08 38.84,21.08 38.79,21.03 33.07,21.03
VCC3V3 on Top Layer: 41.55,7.72 43.58,7.72 43.58,7.01 43.74,6.86 43.74,4.99 42.63,4.99 42.62,5 42.62,6.66
VCC3V3 on Top Layer: 45.31,13.61 42.09,13.61 41.86,13.39 41.86,12.78 40.49,12.78 40.41,12.7 40.41,8.87 42.04,7.24 43.58,7.24 43.58,12.06 43.66,12.14 45.21,12.14 45.31,12.24
VCC3V3 on Inner2: 40.39,12.73 40.39,10.13 42.49,8.02 42.49,4.88 43.81,4.88 43.81,8.42 42.61,9.63 42.61,12.72
BATADC on Bottom Layer: 38.23,16.76 35.79,16.76 35.77,16.74 35.77,14.23 35.88,14.12 36.99,14.12 36.99,15.42 37.06,15.49 38.2,15.49 38.25,15.55 38.25,16.74
VSA1 on Top Layer: -1.22,23.42 12.06,23.42 12.06,18.92 -1.22,18.92
VSA1 on Top Layer: 6.96,22.73 12.06,22.73 12.06,19.88 6.96,19.88
VSA2 on Top Layer: 51.92,10.44 57.07,10.44 57.07,7.59 51.92,7.59
VSA2 on Top Layer: 65.2,7.6 51.92,7.6 51.92,12.1 65.2,12.1
VSB1 on Top Layer: 6.96,17.17 12.06,17.17 12.06,14.3 6.96,14.3
VSB1 on Top Layer: -1.22,17.83 12.06,17.83 12.06,13.34 -1.22,13.34
VSB1 on Bottom Layer: 15.47,9.83 16.74,9.83 16.74,8.81 15.47,8.81
VSB2 on Top Layer: 51.92,16.03 57.07,16.03 57.07,13.18 51.92,13.18
VSB2 on Top Layer: 65.2,13.16 51.92,13.16 51.92,17.66 65.2,17.66
VSC1 on Top Layer: -1.22,12.24 12.06,12.24 12.06,7.75 -1.22,7.75
VSC1 on Top Layer: 6.96,11.56 12.06,11.56 12.06,8.71 6.96,8.71
VSC2 on Top Layer: 51.92,21.62 57.07,21.62 57.07,18.77 51.92,18.77
VSC2 on Top Layer: 65.2,18.78 51.92,18.78 51.92,23.27 65.2,23.27
$1N11613 on Top Layer: 23.6,17.42 20.88,17.42 20.88,16.07 23.6,16.07
$1N11614 on Top Layer: 20.65,17.4 19.99,17.4 19.99,15.98 19.91,15.9 18.87,15.9 18.72,15.75 18.72,14.48 18.75,14.45 21.87,14.45 21.92,14.5 21.92,14.68 22.35,15.11 23.32,15.11 23.37,15.16 23.37,15.98 23.34,16 20.75,16 20.65,16.1
$1N11615 on Top Layer: 22.05,24.08 21.11,24.08 18.9,19.71 18.9,18.36 18.95,18.31 20.75,18.31 20.78,18.34 20.78,19.74 20.93,19.89 21.54,19.89 21.82,19.61 21.82,18.64 21.9,18.57 23.37,18.57 23.37,20.12 23.34,20.14 22.58,20.14 22.05,20.68
$1N14919 on Bottom Layer: 37.06,12.06 40.46,12.06 40.46,8.7 38.91,8.7 38.91,11.07 37.11,11.07 37.06,11.12
$1N19068 on Top Layer: 44.22,17.45 46.84,17.45 46.84,16.08 44.22,16.08
$1N19069 on Top Layer: 44.15,16.13 44.07,16.2 44.07,17.35 43.92,17.5 43.26,17.5 43.1,17.35 43.1,16.2 43.03,16.13 41.91,16.13 41.91,14.33 41.86,14.28 46.79,14.28 46.79,16.1 46.81,16.13
$1N19070 on Top Layer: 42.11,24.13 43.13,24.13 43.13,19.96 44.15,19.96 44.15,18.47 42.32,18.47 41.91,18.87 40.64,18.87 40.64,20 42.11,20 42.11,24.13

Small or netless copper shapes (teardrops, artwork), in the pictures only: 125 on Top Layer, 175 on Bottom Layer, 55 on Inner1, 30 on Inner2

## Text on the board
Bottom Solder Mask Layer: V1.2 | 华东理工大学 / 无贰战队 / 2025/04/13 / 无刷电机驱动板
Bottom Silkscreen Layer: YienMaster
Top Layer: ECUST / 无贰战队 / 25/4/13
